# EAGLE design Przelacznik (EAGLE 8.6.1)
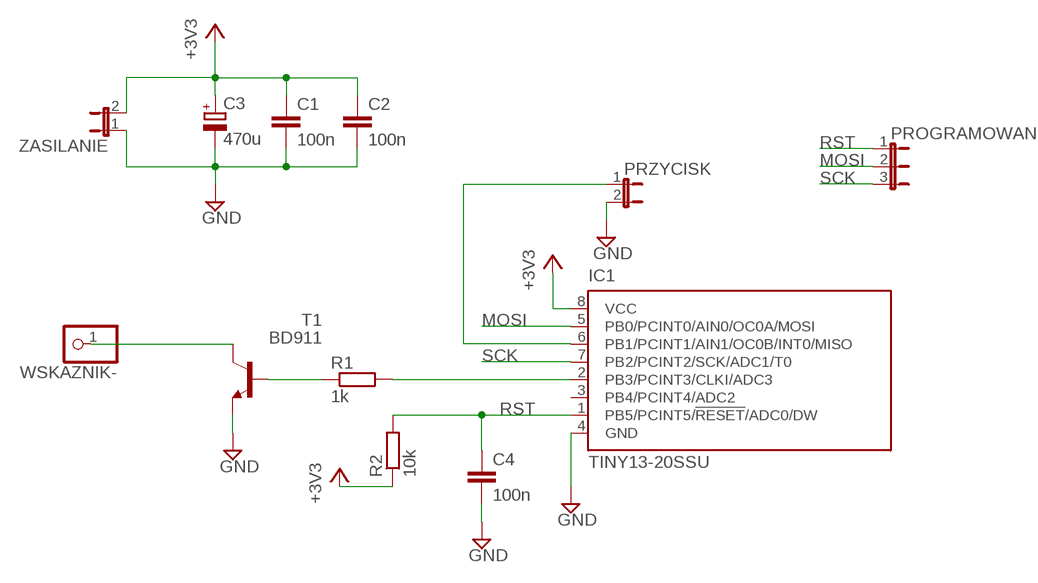
[diagram p0: schematic, sheet 1]

## Parts
C1  100n  C-EU025-024X044  [C025-024X044]
C2  100n  C-EUC0805  [C0805]
C3  470u  CPOL-EUE3.5-8  [E3,5-8]
C4  100n  C-EU025-024X044  [C025-024X044]
IC1  TINY13-20SSU  [8S1]
PROGRAMOWANIE  JP2E  [JP2]
PRZYCISK  JP1E  [JP1]
R1  1k  R-EU_0411/12  [0411/12]
R2  10k  R-EU_0411/12  [0411/12]
T1  BD911  -NPN-TO220  [TO220]
WSKAZNIK-  PINHD-1X1  [1X01]
ZASILANIE  JP1E  [JP1]

## Nets
+3V3: C1.1 C2.1 C3.+ IC1.8(VCC) R2.1 ZASILANIE.2
GND: C1.2 C2.2 C3.- C4.2 IC1.4(GND) PRZYCISK.2 T1.3(E) ZASILANIE.1
MOSI: IC1.5(PB0/PCINT0/AIN0/OC0A/MOSI) PROGRAMOWANIE.2
N$1: T1.2(C) WSKAZNIK-.1
N$2: R1.1 T1.1(B)
N$3: IC1.2(PB3/PCINT3/CLKI/ADC3) R1.2
N$5: IC1.6(PB1/PCINT1/AIN1/OC0B/INT0/MISO) PRZYCISK.1
RST: C4.1 IC1.1(PB5/PCINT5/!RESET!/ADC0/DW) PROGRAMOWANIE.1 R2.2
SCK: IC1.7(PB2/PCINT2/SCK/ADC1/T0) PROGRAMOWANIE.3
Unconnected: IC1.3(PB4/PCINT4/ADC2)

## Library data of the parts
C1 C2 C4 = rcl:C-EU: CAPACITOR, European symbol; SPICEPREFIX: C
C3 = rcl:CPOL-EU: POLARIZED CAPACITOR, European symbol; SPICEPREFIX: C
IC1 = atmel:TINY13: 8-bit AVR Microcontroller with 1K Bytes In-System Programmable Flash Source: http://www.atmel.com/dyn/resources/prod_documents/2535S.pdf; MPN: ATTINY13-20SSU; OC_FARNELL: 1455133; OC_NEWARK: 58M3771
PROGRAMOWANIE = jumper:JP2E: JUMPER
PRZYCISK ZASILANIE = jumper:JP1E: JUMPER
R1 R2 = rcl:R-EU_: RESISTOR, European symbol; SPICEPREFIX: R
T1 = transistor:*-NPN-: NPN Transistror BF959 corrected 2008.03.06
WSKAZNIK- = pinhead:PINHD-1X1: PIN HEADER

## Board
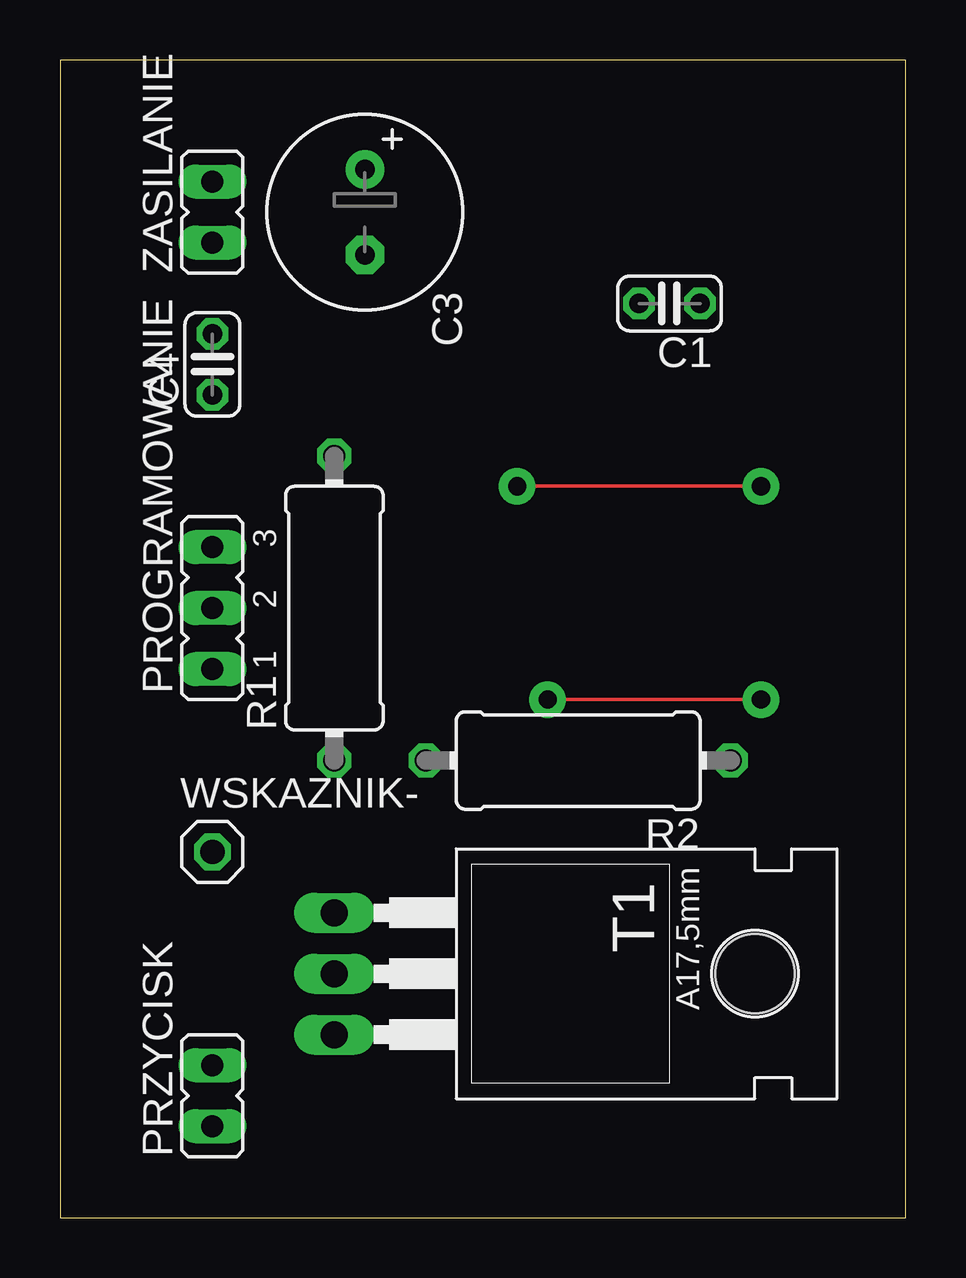
[diagram p1: board, top side]
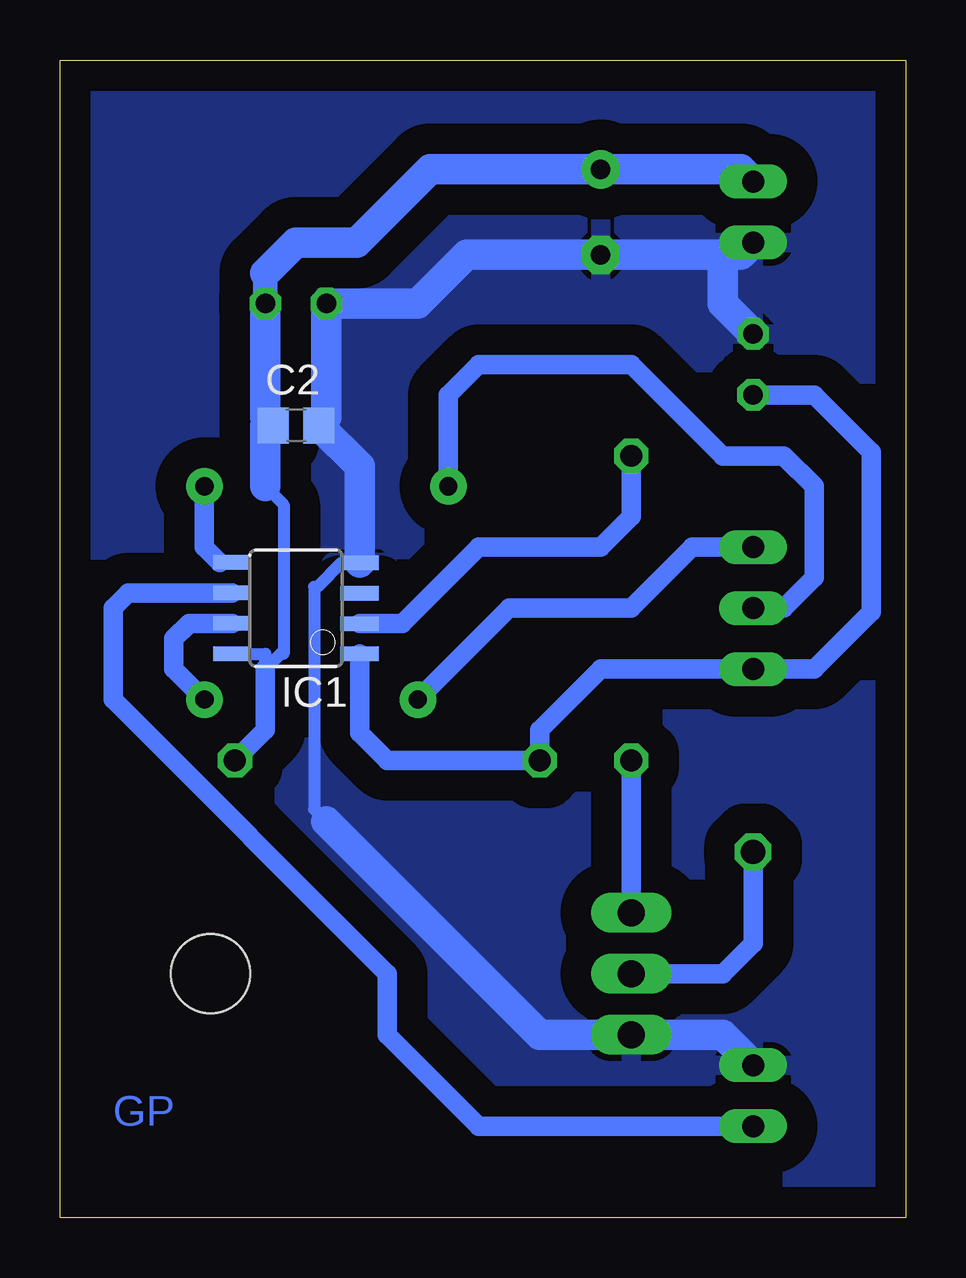
[diagram p2: board, bottom side, seen from below]

Size 35.23 x 48.25 mm. Coordinates in mm from the lower left corner, seen from the top.
Outline: 0,0 35.23,0 35.23,48.25 0,48.25 0,0
Copper layers (1*16): Top 0.035mm / dielectric 1.5mm / Bottom 0.035mm
Design rules "default": minimum track width 6mil, minimum drill 0.35mm, track to track 6mil, track to pad 6mil, pad to pad 6mil, via to via 6mil, smd to smd 6mil, copper to edge 40mil, drill to drill 6mil, minimum pad ring 10mil, minimum via ring 8mil, stop-mask expansion 4mil, vias tented up to drill 0mil, thermal gap 10mil

### Footprints (pad centres in the part's own frame; a part is rotated, then mirrored left to right if it is on the bottom)
C025-024X044 = drill 0.813 octagon: 1 -1.27,0; 2 1.27,0
C0805 = smd 1.3 x 1.5: 1 -0.95,0; 2 0.95,0
E3,5-8 = drill 0.813 pad 1.6: + -1.778,0 | drill 0.813 pad 1.6 octagon: - 1.778,0
8S1 = smd 0.6 x 1.6: 1 -1.905,-2.654; 2 -0.645,-2.654; 3 0.625,-2.654; 4 1.895,-2.654; 5 1.905,2.654; 6 0.635,2.654; 7 -0.635,2.654; 8 -1.905,2.654
JP2 = drill 0.914 long: 1 -2.54,0; 2 0,0; 3 2.54,0
JP1 = drill 0.914 long: 1 0,-1.27; 2 0,1.27
0411/12 = drill 0.914 octagon: 1 -6.35,0; 2 6.35,0
TO220 = drill 1.118 long: 1 -2.54,-6.35; 2 0,-6.35; 3 2.54,-6.35 | hole 3.302: 0,11.176
1X01 = drill 1.016 octagon: 1 0,0

### Placement (x,y rotation side)
C1  25.4,38.1 180 top
C2  25.4,33.02 0 bottom
C3  12.7,41.91 270 top
C4  6.35,35.56 90 top
IC1  25.4,25.4 90 bottom
PROGRAMOWANIE  6.35,25.4 90 top
PRZYCISK  6.35,5.08 0 top
R1  11.43,25.4 90 top
R2  21.59,19.05 180 top
T1  17.78,10.16 270 top
WSKAZNIK-  6.35,15.24 0 top
ZASILANIE  6.35,41.91 0 top

### Tracks (layer width: path | path; a pad name or v marks a point on that pad's centre or on a via)
+3V3
  Bottom 0.152: 26.67,33.34 26.51,33.18 | 26.51,33.18 C2.1 | 26.67,33.02 26.51,33.18
  Bottom 0.508: IC1.8 26.67,23.49 26.67,22.86 26.04,23.49 25.91,23.49 25.91,29.72 26.67,30.48
  Bottom 0.813: R2.1 26.67,20.32 26.67,22.86
  Bottom 1.016: 26.67,39.37 C1.1
  Bottom 1.27: ZASILANIE.2 6.86,43.69 C3.+ 19.81,43.69 22.86,40.64 25.4,40.64 26.67,39.37 | C1.1 26.67,33.34 | 26.67,33.02 26.67,30.48
GND
  Bottom 0.152: 24.13,33.34 C2.2 | IC1.4 23.5,27.3
  Bottom 0.508: 24.13,16.51 24.64,17.02 24.64,26.29 24.51,26.29 23.5,27.3
  Bottom 1.016: T1.3 10.16,7.62
  Bottom 1.27: 7.62,40.13 C3.- 18.29,40.13 20.32,38.1 C1.2 24.13,33.34 | 7.62,40.13 6.86,40.13 ZASILANIE.1 | C4.2 7.62,38.1 7.62,40.13 | C2.2 22.75,31.32 IC1.4 | 24.13,16.51 15.24,7.62 T1.3 7.62,7.62 PRZYCISK.2
  pour Bottom (isolate 1.27): 0,48.26 35.56,48.26 35.56,0 0,0
MOSI  (via drill 0.76 pad 1.52)
  Top 0.152: v29.21,30.48 v19.05,30.48
  Bottom 0.152: IC1.5 27.94,27.42
  Bottom 0.508: IC1.5 28.57,27.3
  Bottom 0.813: PROGRAMOWANIE.2 5.08,25.4 3.81,26.67 3.81,30.48 5.08,31.75 7.62,31.75 11.43,35.56 17.78,35.56 19.05,34.29 v19.05,30.48 | 28.57,27.3 29.21,27.94 v29.21,30.48
N$1
  Bottom 0.813: T1.2 7.62,10.16 6.35,11.43 WSKAZNIK-.1
N$2
  Bottom 0.813: R1.1 11.43,15.24 T1.1
N$3
  Bottom 0.813: IC1.2 20.96,24.76 17.78,27.94 12.7,27.94 11.43,29.21 R1.2
N$5
  Bottom 0.813: PRZYCISK.1 17.78,3.81 21.59,7.62 21.59,10.16 33.02,21.59 33.02,25.4 32.38,26.03 IC1.6
RST
  Bottom 0.813: IC1.1 22.75,20.21 21.59,19.05 R2.2 15.24,20.32 12.7,22.86 PROGRAMOWANIE.1 3.81,22.86 1.42,25.25 1.42,31.9 3.81,34.29 C4.1
SCK  (via drill 0.76 pad 1.52)
  Top 0.152: v29.21,21.59 v20.32,21.59
  Bottom 0.813: IC1.7 29.84,24.77 30.48,24.13 30.48,22.86 v29.21,21.59 | 7.62,27.94 PROGRAMOWANIE.3 8.89,27.94 11.43,25.4 16.51,25.4 v20.32,21.59

### Text on the board
Bottom: GP